# Altium schematic sheet nogyr.SchDoc
size A3
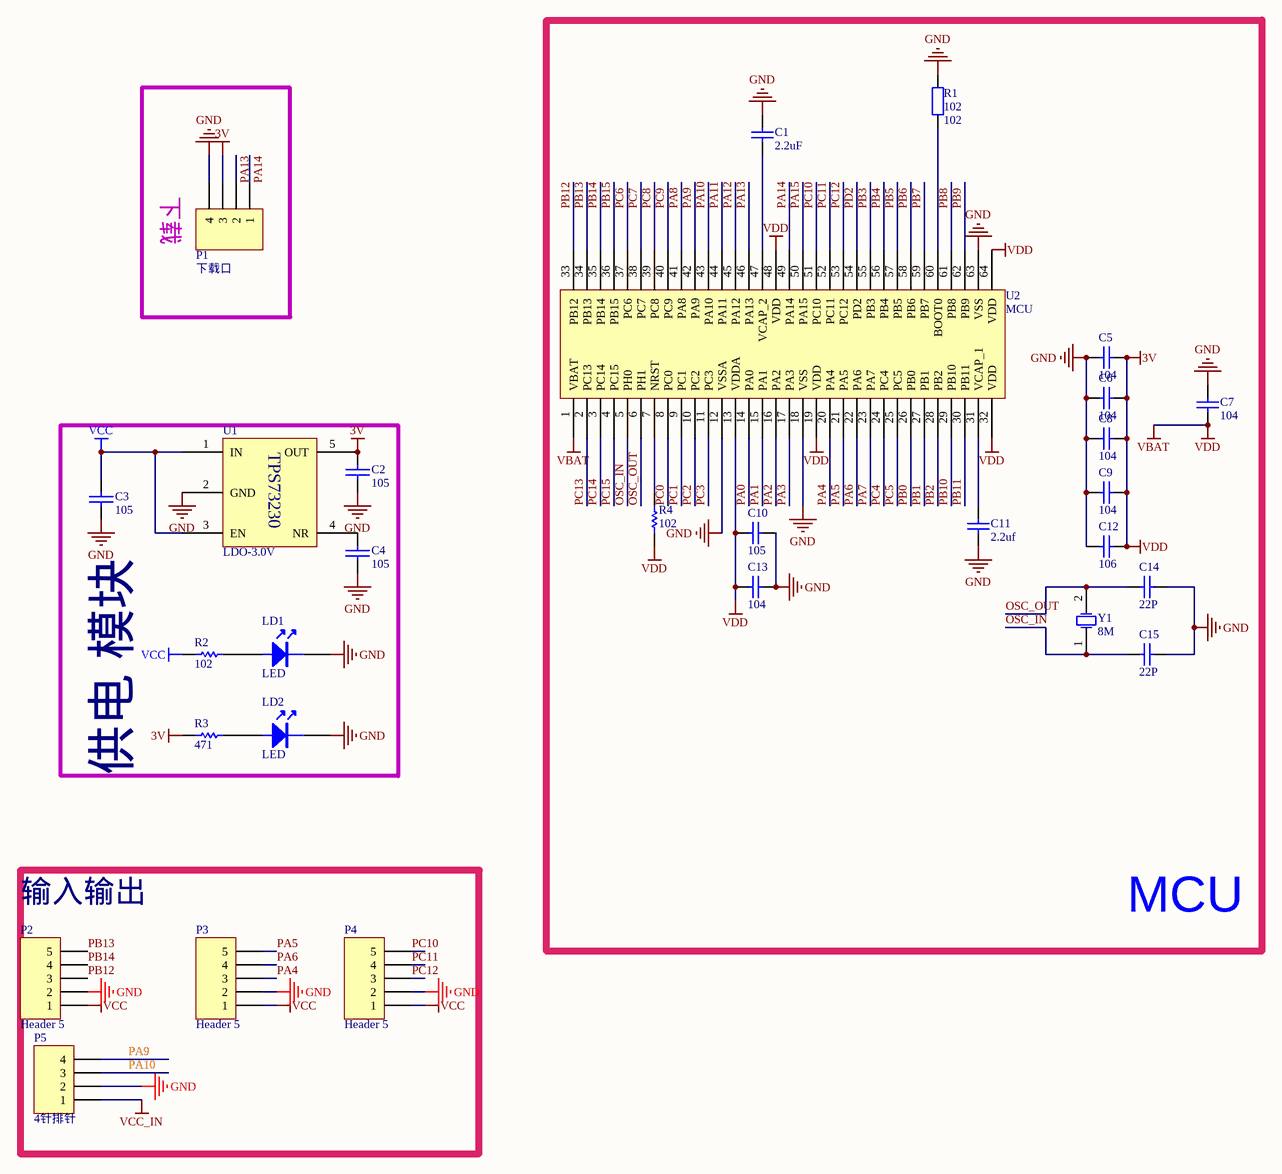
[diagram p0: nogyr.SchDoc]

## Parts
C1  2.2uF  [C-0603C]
C2  105  [C-0603C]
C3  105  [C-0603C]
C4  105  [C-0603C]
C5  104  [C-0603C]
C6  104  [C-0603C]
C7  104  [C-0603C]
C8  104  [C-0603C]
C9  104  [C-0603C]
C10  105  [C-0603C]
C11  2.2uf  [C-0603C]
C12  106  [C-0603C]
C13  104  [C-0603C]
C14  22P  [0603C]
C15  22P  [0603C]
LD1  LED  [0603C]
LD2  LED  [0603C]
P1  下载口  [HDR1X4]
P2  Header 5  [FPC5-1.0]
P3  Header 5  [FPC5-1.0]
P4  Header 5  [FPC5-1.0]
P5  4针排针  [HDR1X4]
R1  102  [C-0603C]
R2  102  [R-0603R]
R3  471  [R-0603R]
R4  102  [R-0603R]
U1  LDO-3.0V  [SOT-235]
U2  MCU  [LQFP64-STM32F405RG]
Y1  8M  [晶振-crystals]

## Blocks framed on the sheet
MCU: C1 C5-C15 R1 R4 U2 Y1
下载: P1
供电 模块: C2-C4 LD1 LD2 R2 R3 U1
输入输出: P2-P5

## Nets
3V: C2.1 C5.1 C6.1 C7.1 C8.1 C9.1 C10.1 C12.1 C13.1 P1.3 R3.1 R4.2 U1.5(OUT) U2.1(VBAT) U2.13(VDDA) U2.19(VDD) U2.32(VDD) U2.48(VDD) U2.64(VDD)  [also labelled VBAT, VDD]
GND: C1.2 C2.2 C3.2 C4.2 C5.2 C6.2 C7.2 C8.2 C9.2 C10.2 C11.1 C12.2 C13.2 C14.2 C15.2 LD1.K LD2.K P1.4 P2.2 P3.2 P4.2 P5.2 R1.2 U1.2(GND) U2.12(VSSA) U2.18(VSS) U2.63(VSS)
VCC: C3.1 P2.1 P3.1 P4.1 R2.1 U1.1(IN) U1.3(EN)
VCC_IN: P5.1
OSC_IN: C15.1 U2.5(PH0) Y1.1(OSC1)
OSC_OUT: C14.1 U2.6(PH1) Y1.2(OSC2)
PA0: U2.14(PA0)
PA1: U2.15(PA1)
PA2: U2.16(PA2)
PA3: U2.17(PA3)
PA4: P3.3 U2.20(PA4)
PA5: P3.5 U2.21(PA5)
PA6: P3.4 U2.22(PA6)
PA7: U2.23(PA7)
PA8: U2.41(PA8)
PA9: P5.4 U2.42(PA9)
PA10: P5.3 U2.43(PA10)
PA11: U2.44(PA11)
PA12: U2.45(PA12)
PA13: P1.2 U2.46(PA13)
PA14: P1.1 U2.49(PA14)
PA15: U2.50(PA15)
PB0: U2.26(PB0)
PB1: U2.27(PB1)
PB2: U2.28(PB2)
PB3: U2.55(PB3)
PB4: U2.56(PB4)
PB5: U2.57(PB5)
PB6: U2.58(PB6)
PB7: U2.59(PB7)
PB8: U2.61(PB8)
PB9: U2.62(PB9)
PB10: U2.29(PB10)
PB11: U2.30(PB11)
PB12: P2.3 U2.33(PB12)
PB13: P2.5 U2.34(PB13)
PB14: P2.4 U2.35(PB14)
PB15: U2.36(PB15)
PC0: U2.8(PC0)
PC1: U2.9(PC1)
PC2: U2.10(PC2)
PC3: U2.11(PC3)
PC4: U2.24(PC4)
PC5: U2.25(PC5)
PC6: U2.37(PC6)
PC7: U2.38(PC7)
PC8: U2.39(PC8)
PC9: U2.40(PC9)
PC10: P4.5 U2.51(PC10)
PC11: P4.4 U2.52(PC11)
PC12: P4.3 U2.53(PC12)
PC13: U2.2(PC13)
PC14: U2.3(PC14)
PC15: U2.4(PC15)
PD2: U2.54(PD2)
NetC1_1: C1.1 U2.47(VCAP_2)
NetC4_1: C4.1 U1.4(NR)
NetC11_2: C11.2 U2.31(VCAP_1)
NetLD1_A: LD1.A R2.2
NetLD2_A: LD2.A R3.2
NetR1_1: R1.1 U2.60(BOOT0)
NetR4_1: R4.1 U2.7(NRST)

## Notes on the sheet
- (in symbol TPS73230MDBVREP) TPS73230

## Library data of the parts
C1 C5-C13 = Cap: Capacitor; Published: 8-Jun-2000; LatestRevisionDate: 17-Jul-2002; LatestRevisionNote: Re-released for DXP Platform.; PackageReference: RAD-0.3; Publisher: Altium Limited
  C1: Value: 2.2uF
  C5-C9 C13: Value: 104
  C10: Value: 105
  C11: Value: 2.2uf
  C12: Value: 106
C2-C4 = CAP: Capacitor
C14 C15 = Cap: Capacitor; Value: 100pF; Published: 8-Jun-2000; LatestRevisionDate: 17-Jul-2002; LatestRevisionNote: Re-released for DXP Platform.; PackageReference: RAD-0.3; Publisher: Altium Limited
LD1 LD2 = LED: pin to pad: A>1 K>2
P1 P5 = Header 4: Header, 4-Pin; LatestRevisionDate: 17-Jul-2002; LatestRevisionNote: Re-released for DXP Platform.; Publisher: Altium Limited
P2-P4 = Header 5: Header, 5-Pin; LatestRevisionDate: 17-Jul-2002; LatestRevisionNote: Re-released for DXP Platform.; Publisher: Altium Limited
R1 = Res2: Resistor; Published: 8-Jun-2000; LatestRevisionDate: 17-Jul-2002; LatestRevisionNote: Re-released for DXP Platform.; PackageReference: AXIAL-0.4; Publisher: Altium Limited; Value: 102
R2-R4 = Res Semi: Semiconductor Resistor; Published: 8-Jun-2000; LatestRevisionDate: 17-Jul-2002; LatestRevisionNote: Re-released for DXP Platform.; PackageReference: AXIAL-0.5; Publisher: Altium Limited; PackageDescription: Axial Device, Thru-Hole; 2 Leads; 0.5 in Pin Spacing
  R2 R4: Value: 102
  R3: Value: 471
U1 = TPS73230MDBVREP
U2 = STM32F405RGT7
Y1 = XTAL: Crystal Oscillator; Published: 8-Jun-2000; LatestRevisionDate: 17-Jul-2002; LatestRevisionNote: Re-released for DXP Platform.; PackageReference: R38; Publisher: Altium Limited